# EAGLE design switcher (EAGLE 7.6.0)
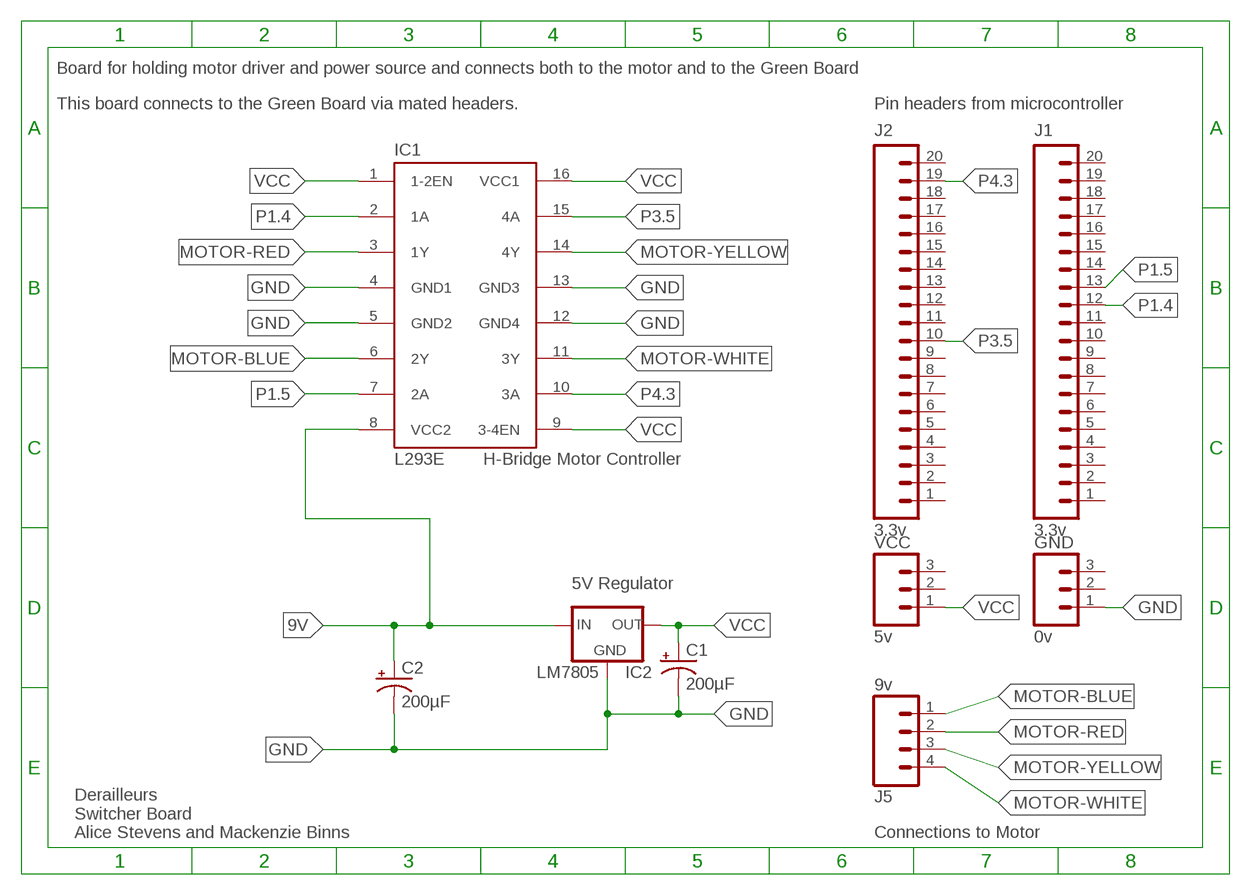
[diagram p0: schematic, sheet 1]

## Parts
C1  200µF  CAP_POLPTH1  [CPOL-RADIAL-100UF-25V]
C2  200µF  CAP_POLPTH1  [CPOL-RADIAL-100UF-25V]
GND  0v  M03PTH  [1X03]
IC1  L293E  [DIL16]
IC2  78XXL  [78XXL]
J1  3.3v  M20  [1X20]
J2  3.3v  M20  [1X20]
J5  9v  M04PTH  [1X04]
VCC  5v  M03PTH  [1X03]

## Nets
9V: C2.1(+) IC1.8(VCC2) IC2.IN
GND: C1.2(-) C2.2(-) GND.1 IC1.4(GND1) IC1.5(GND2) IC1.12(GND4) IC1.13(GND3) IC2.GND
MOTOR-BLUE: IC1.6(2Y) J5.1
MOTOR-RED: IC1.3(1Y) J5.2
MOTOR-WHITE: IC1.11(3Y) J5.4
MOTOR-YELLOW: IC1.14(4Y) J5.3
P1.4: IC1.2(1A) J1.12
P1.5: IC1.7(2A) J1.13
P3.5: IC1.15(4A) J2.10
P4.3: IC1.10(3A) J2.19
VCC: C1.1(+) IC1.1(1-2EN) IC1.9(3-4EN) IC1.16(VCC1) IC2.OUT VCC.1
Unconnected: GND.2 GND.3 J1.1 J1.2 J1.3 J1.4 J1.5 J1.6 J1.7 J1.8 J1.9 J1.10 J1.11 J1.14 J1.15 J1.16 J1.17 J1.18 J1.19 J1.20 J2.1 J2.2 J2.3 J2.4 J2.5 J2.6 J2.7 J2.8 J2.9 J2.11 J2.12 J2.13 J2.14 J2.15 J2.16 J2.17 J2.18 J2.20 VCC.2 VCC.3

## Notes on the sheet
- Board for holding motor driver and power source and connects both to the motor and to the Green Board
- This board connects to the Green Board via mated headers. | Pin headers from microcontroller
- H-Bridge Motor Controller
- 5V Regulator
- LM7805
- Derailleurs
  Switcher Board
  Alice Stevens and Mackenzie Binns
- Connections to Motor

## Library data of the parts
C1 C2 = SparkFun-Capacitors:CAP_POL: Capacitor Polarized These are standard SMD and PTH capacitors. Normally 10uF, 47uF, and 100uF in electrolytic and tantalum varieties. Always verify the external diameter of the through hole cap, it varies with capacity, voltage, and manufacturer. The EIA devices should be standard.
GND VCC = SparkFun-Connectors:M03: Header 3 Standard 3-pin 0.1" header. Use with straight break away headers (SKU : PRT-00116), right angle break away headers (PRT-00553), swiss pins (PRT-00743), machine pins (PRT-00117), and female headers (PRT-00115). Molex polarized connector foot print use with SKU : PRT-08232 with associated crimp pins and housings.
IC1 = texas:L293E: TI DEVICE; MF: Arrow Electronics; MPN: L293E; OC_FARNELL: 1467711; OC_NEWARK: 89K0732
IC2 = v-reg:78XXL: VOLTAGE REGULATOR
J1 J2 = SparkFun-Connectors:M20: 1x20 .1" header This is just like the LOCK variant in that the holes are staggared by 5 mil, but except for the last two holes. They are not altered from the "standard" footprint layout. This is used for a special purpose on the layout of our Graphic LCD Backpack. Make sure you want to use this device before selecting it for you project!
J5 = SparkFun-Connectors:M04: Header 4 Standard 4-pin 0.1" header. Use with straight break away headers (SKU : PRT-00116), right angle break away headers (PRT-00553), swiss pins (PRT-00743), machine pins (PRT-00117), and female headers (PRT-00115). Molex polarized connector foot print use with SKU : PRT-08231 with associated crimp pins and housings. 1MM SMD Version SKU: PRT-10208; PROD_ID: CONN-09696

## Board
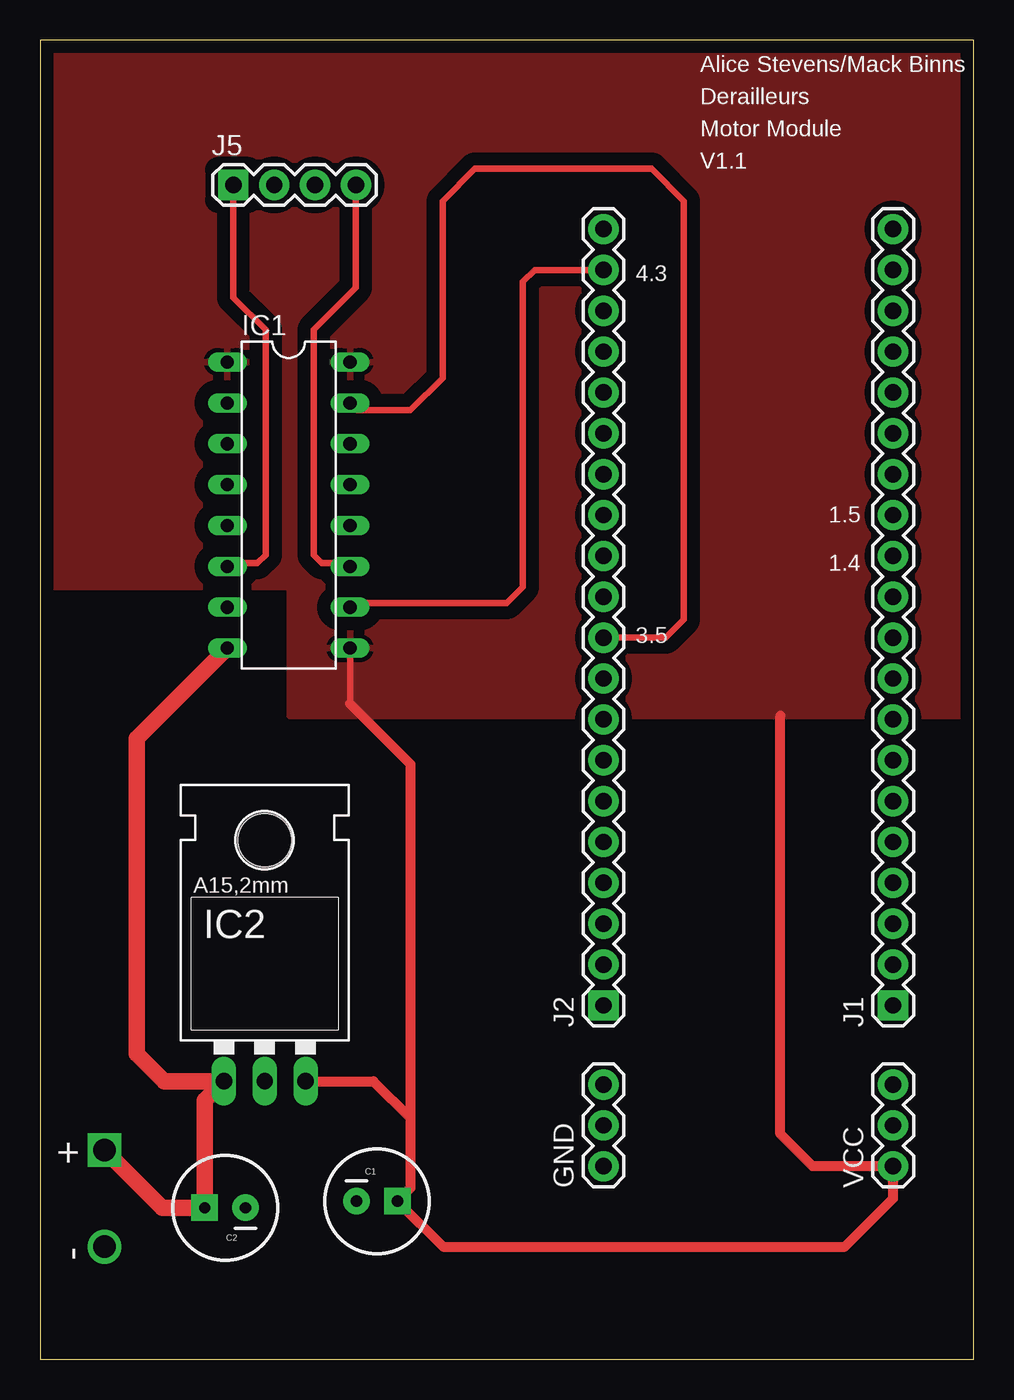
[diagram p1: board, top side]
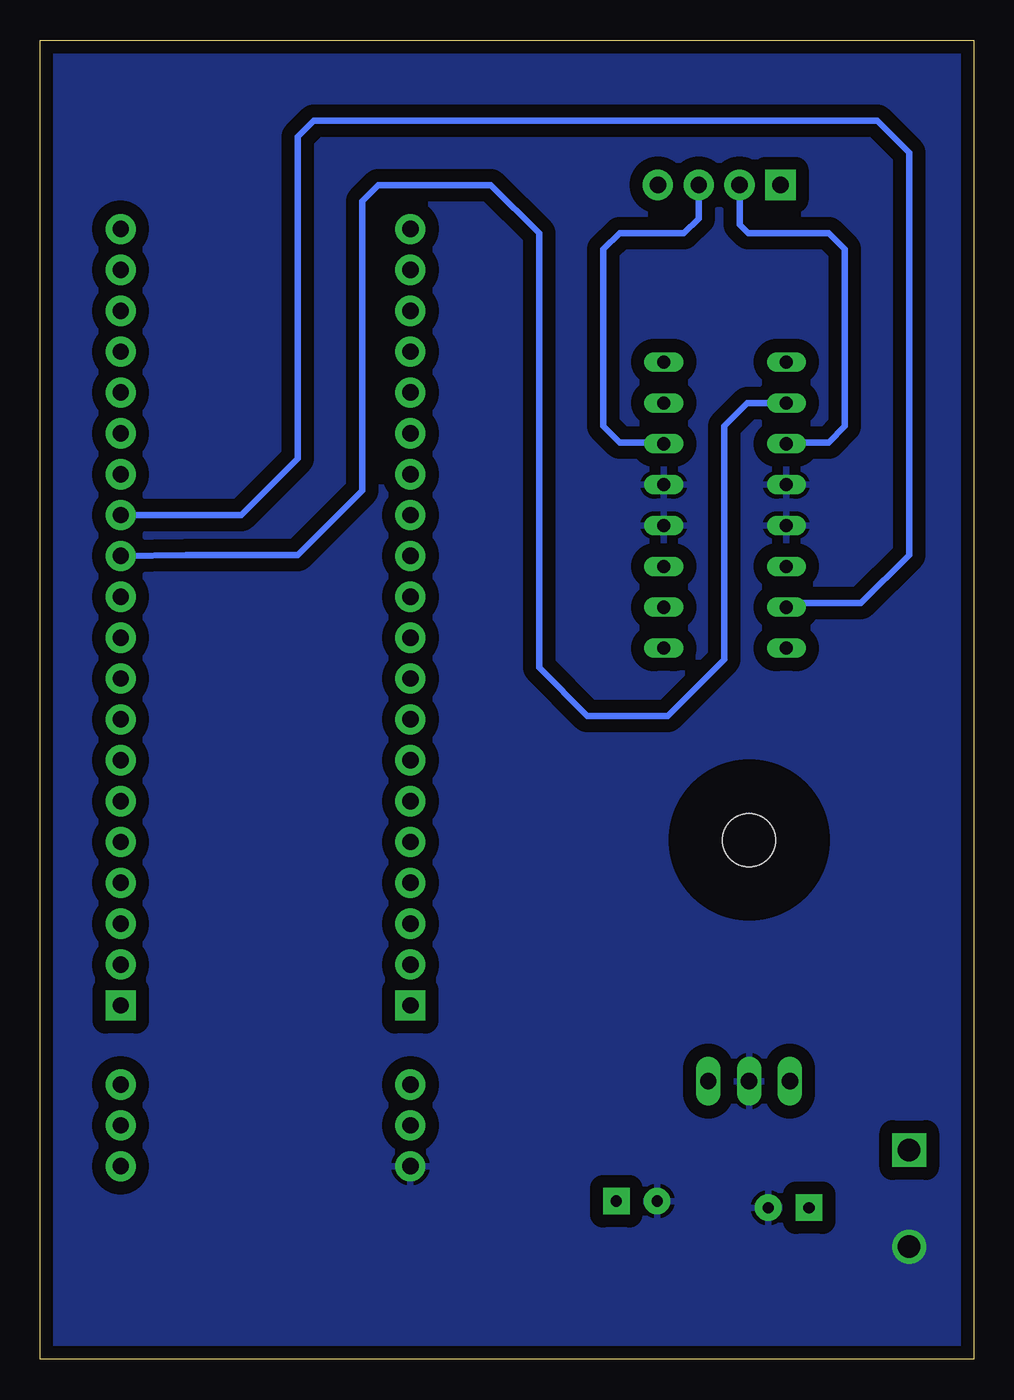
[diagram p2: board, bottom side, seen from below]

Size 58 x 82 mm. Coordinates in mm from the lower left corner, seen from the top.
Outline: 0,0 58,0 58,82 0,82 0,0
Copper layers (1*16): Top 0.0356mm / dielectric 1.5011mm / Bottom 0.0356mm
Design rules "LaenPCBOrder": minimum track width 6mil, minimum drill 13mil, track to track 6mil, track to pad 6mil, pad to pad 6mil, via to via 6mil, smd to smd 6mil, copper to edge 15mil, drill to drill 6mil, minimum pad ring 7mil, minimum via ring 7mil, stop-mask expansion 3mil, vias tented up to drill 0mil, thermal gap 10mil

### Footprints (pad centres in the part's own frame; a part is rotated, then mirrored left to right if it is on the bottom)
CPOL-RADIAL-100UF-25V = drill 0.7 pad 1.651 square: 1 1.27,0 | drill 0.7 pad 1.651: 2 -1.27,0
1X03 = drill 1.016 pad 1.88: 1 0,0; 2 2.54,0; 3 5.08,0
DIL16 = drill 0.813 long: 1 -8.89,-3.81; 2 -6.35,-3.81; 3 -3.81,-3.81; 4 -1.27,-3.81; 5 1.27,-3.81; 6 3.81,-3.81; 7 6.35,-3.81; 8 8.89,-3.81; 9 8.89,3.81; 10 6.35,3.81; 11 3.81,3.81; 12 1.27,3.81; 13 -1.27,3.81; 14 -3.81,3.81; 15 -6.35,3.81; 16 -8.89,3.81
78XXL = drill 1.016 long: GND 0,-3.81; IN -2.54,-3.81; OUT 2.54,-3.81 | hole 3.302: 0,11.176
1X20 = drill 1.016 pad 1.88 square: 1 0,0 | drill 1.016 pad 1.88: 2 2.54,0; 3 5.08,0; 4 7.62,0; 5 10.16,0; 6 12.7,0; 7 15.24,0; 8 17.78,0; 9 20.32,0; 10 22.86,0; 11 25.4,0; 12 27.94,0; 13 30.48,0; 14 33.02,0; 15 35.56,0; 16 38.1,0; 17 40.64,0; 18 43.18,0; 19 45.72,0; 20 48.26,0
1X04 = drill 1.016 pad 1.88 square: 1 0,0 | drill 1.016 pad 1.88: 2 2.54,0; 3 5.08,0; 4 7.62,0

### Placement (x,y rotation side)
C1  20.93,9.83 0 top
C2  11.49,9.42 180 top
GND  35,12 90 top
IC1  15.44,53.1 270 top
IC2  13.95,21.1 0 top
J1  53,22 90 top
J2  35,22 90 top
J5  12,73 0 top
VCC  53,12 90 top

### Tracks (layer width: path | path; a pad name or v marks a point on that pad's centre or on a via)
9V  (via drill 1.4)
  Top 1.016: v4,13 7.58,9.42 C2.1 10.22,16.1 IC2.IN 7.71,17.29 6,19 6,38.58 IC1.8
GND  (via drill 1.4)
  other vias: 4,7
  pour Bottom (isolate 0.813): 0,0 55,0 58,1 58,82 0,82
MOTOR-BLUE
  Top 0.406: J5.1 12,66 14,64 14,50 13.5,49.5 11.84,49.5 IC1.6
MOTOR-RED
  Bottom 0.406: J5.2 14.54,70.54 14,70 9,70 8,69 8,58 9,57 11.54,57 IC1.3
MOTOR-WHITE
  Top 0.406: J5.4 19.62,66.62 17,64 17,50 17.5,49.5 19.04,49.5 IC1.11
MOTOR-YELLOW
  Bottom 0.406: J5.3 17.08,70.92 18,70 22,70 23,69 23,58 22,57 19.34,57 IC1.14
P1.4
  Bottom 0.406: IC1.2 14.05,59.45 15.5,58 15.5,43.5 19,40 24,40 27,43 27,70 30,73 37,73 38,72 38,54 42,50 48.94,50 J1.12
P1.5
  Bottom 0.406: J1.13 45.52,52.48 42,56 42,76 41,77 6,77 4,75 4,50 7,47 11.38,47 IC1.7
P3.5
  Top 0.406: J2.10 38.86,44.86 40,46 40,72 38,74 27,74 25,72 25,61 23,59 19.7,59 IC1.15
P4.3
  Top 0.406: J2.19 30.72,67.72 30,67 30,48 29,47 19.5,47 IC1.10
VCC
  Top 0.406: IC1.9 19.25,40.75
  Top 0.61: 46,40 46,14 48,12 VCC.1 53,10 50,7 25.03,7 C1.1 23,10.63 23,15 | IC2.OUT 20.71,17.29 23,15 | 19.25,40.75 23,37 23,15
  pour Top (isolate 0.813): 0,82 58,82 58,40 15.5,40 15.5,48 0,48

### Text on the board
Rect_Pads: BLUE | RED | YELLOW | WHITE
_tsilk: Alice Stevens/Mack Binns | Derailleurs | Motor Module | V1.1 | 4.3 | 1.5 | 1.4 | 3.5 | + | -